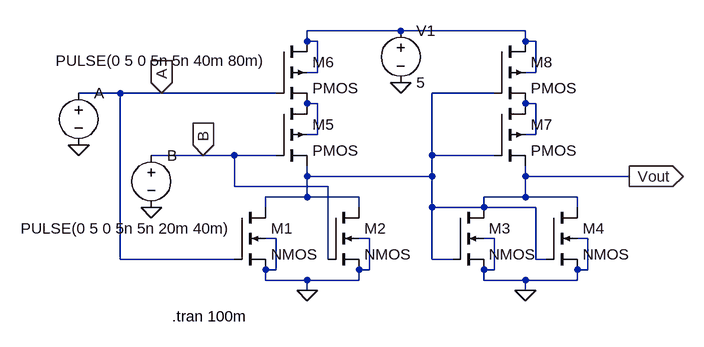
[diagram p0: schematic OR.asc]
OR.asc, the LTspice schematic file:
Version 4.1
SHEET 1 880 680
WIRE 288 -64 144 -64
WIRE 480 -64 288 -64
WIRE 144 -48 144 -64
WIRE 160 -48 144 -48
WIRE 480 -48 480 -64
WIRE 496 -48 480 -48
WIRE 160 0 160 -48
WIRE 160 0 144 0
WIRE 496 0 496 -48
WIRE 496 0 480 0
WIRE -144 32 -208 32
WIRE -80 32 -144 32
WIRE 96 32 -80 32
WIRE 432 32 336 32
WIRE 160 48 144 48
WIRE 496 48 480 48
WIRE 160 96 160 48
WIRE 160 96 144 96
WIRE 496 96 496 48
WIRE 496 96 480 96
WIRE -16 128 -96 128
WIRE 32 128 -16 128
WIRE 96 128 32 128
WIRE 336 128 336 32
WIRE 432 128 336 128
WIRE 144 160 144 144
WIRE 336 160 336 128
WIRE 336 160 144 160
WIRE 480 160 480 144
WIRE 640 160 480 160
WIRE 32 176 32 128
WIRE 176 176 32 176
WIRE 144 192 144 160
WIRE 144 192 80 192
WIRE 224 192 144 192
WIRE 480 192 480 160
WIRE 480 192 416 192
WIRE 560 192 480 192
WIRE 80 208 80 192
WIRE 224 208 224 192
WIRE 336 208 336 160
WIRE 416 208 416 192
WIRE 416 208 336 208
WIRE 496 208 416 208
WIRE 560 208 560 192
WIRE 96 256 80 256
WIRE 240 256 224 256
WIRE 432 256 416 256
WIRE 576 256 560 256
WIRE -144 288 -144 32
WIRE 32 288 -144 288
WIRE 176 288 176 176
WIRE 336 288 336 208
WIRE 368 288 336 288
WIRE 496 288 496 208
WIRE 512 288 496 288
WIRE 96 304 96 256
WIRE 96 304 80 304
WIRE 240 304 240 256
WIRE 240 304 224 304
WIRE 432 304 432 256
WIRE 432 304 416 304
WIRE 576 304 576 256
WIRE 576 304 560 304
WIRE 80 320 80 304
WIRE 144 320 80 320
WIRE 224 320 224 304
WIRE 224 320 144 320
WIRE 416 320 416 304
WIRE 480 320 416 320
WIRE 560 320 560 304
WIRE 560 320 480 320
WIRE 144 336 144 320
WIRE 480 336 480 320
FLAG -208 112 0
FLAG -96 208 0
FLAG 288 16 0
FLAG 144 336 0
FLAG 480 336 0
FLAG 640 160 Vout
IOPIN 640 160 Out
FLAG -80 32 A
IOPIN -80 32 In
FLAG -16 128 B
IOPIN -16 128 In
SYMBOL nmos4 32 208 R0
SYMATTR InstName M1
SYMBOL nmos4 176 208 R0
SYMATTR InstName M2
SYMBOL nmos4 368 208 R0
SYMATTR InstName M3
SYMBOL nmos4 512 208 R0
SYMATTR InstName M4
SYMBOL pmos4 96 48 R0
SYMATTR InstName M5
SYMBOL pmos4 96 -48 R0
SYMATTR InstName M6
SYMBOL pmos4 432 48 R0
SYMATTR InstName M7
SYMBOL pmos4 432 -48 R0
SYMATTR InstName M8
SYMBOL voltage 288 -80 R0
WINDOW 123 0 0 Left 0
WINDOW 39 0 0 Left 0
SYMATTR InstName V1
SYMATTR Value 5
SYMBOL voltage -208 16 R0
WINDOW 3 -35 -34 Left 2
WINDOW 123 0 0 Left 0
WINDOW 39 0 0 Left 0
SYMATTR InstName A
SYMATTR Value PULSE(0 5 0 5n 5n 40m 80m)
SYMBOL voltage -96 112 R0
WINDOW 3 -201 128 Left 2
WINDOW 123 0 0 Left 0
WINDOW 39 0 0 Left 0
SYMATTR InstName B
SYMATTR Value PULSE(0 5 0 5n 5n 20m 40m)
TEXT -64 376 Left 2 !.tran 100m

The netlist it stands for:
* OR.asc
M1 Vout A 0 0 NMOS
M2 Vout B 0 0 NMOS
M3 Vout Vout 0 0 NMOS
M4 Vout Vout 0 0 NMOS
M5 N002 B Vout N002 PMOS
M6 N001 A N002 N001 PMOS
M7 N003 Vout Vout N003 PMOS
M8 N001 Vout N003 N001 PMOS
V1 N001 0 5
V§A A 0 PULSE(0 5 0 5n 5n 40m 80m)
V§B B 0 PULSE(0 5 0 5n 5n 20m 40m)
.model NMOS NMOS
.model PMOS PMOS
.lib standard.mos
.tran 100m
.backanno
.end